# Altium schematic sheet 0167_POWER SEQUENCING.SchDoc (part 1 of 2)
size 848 x 558 mm
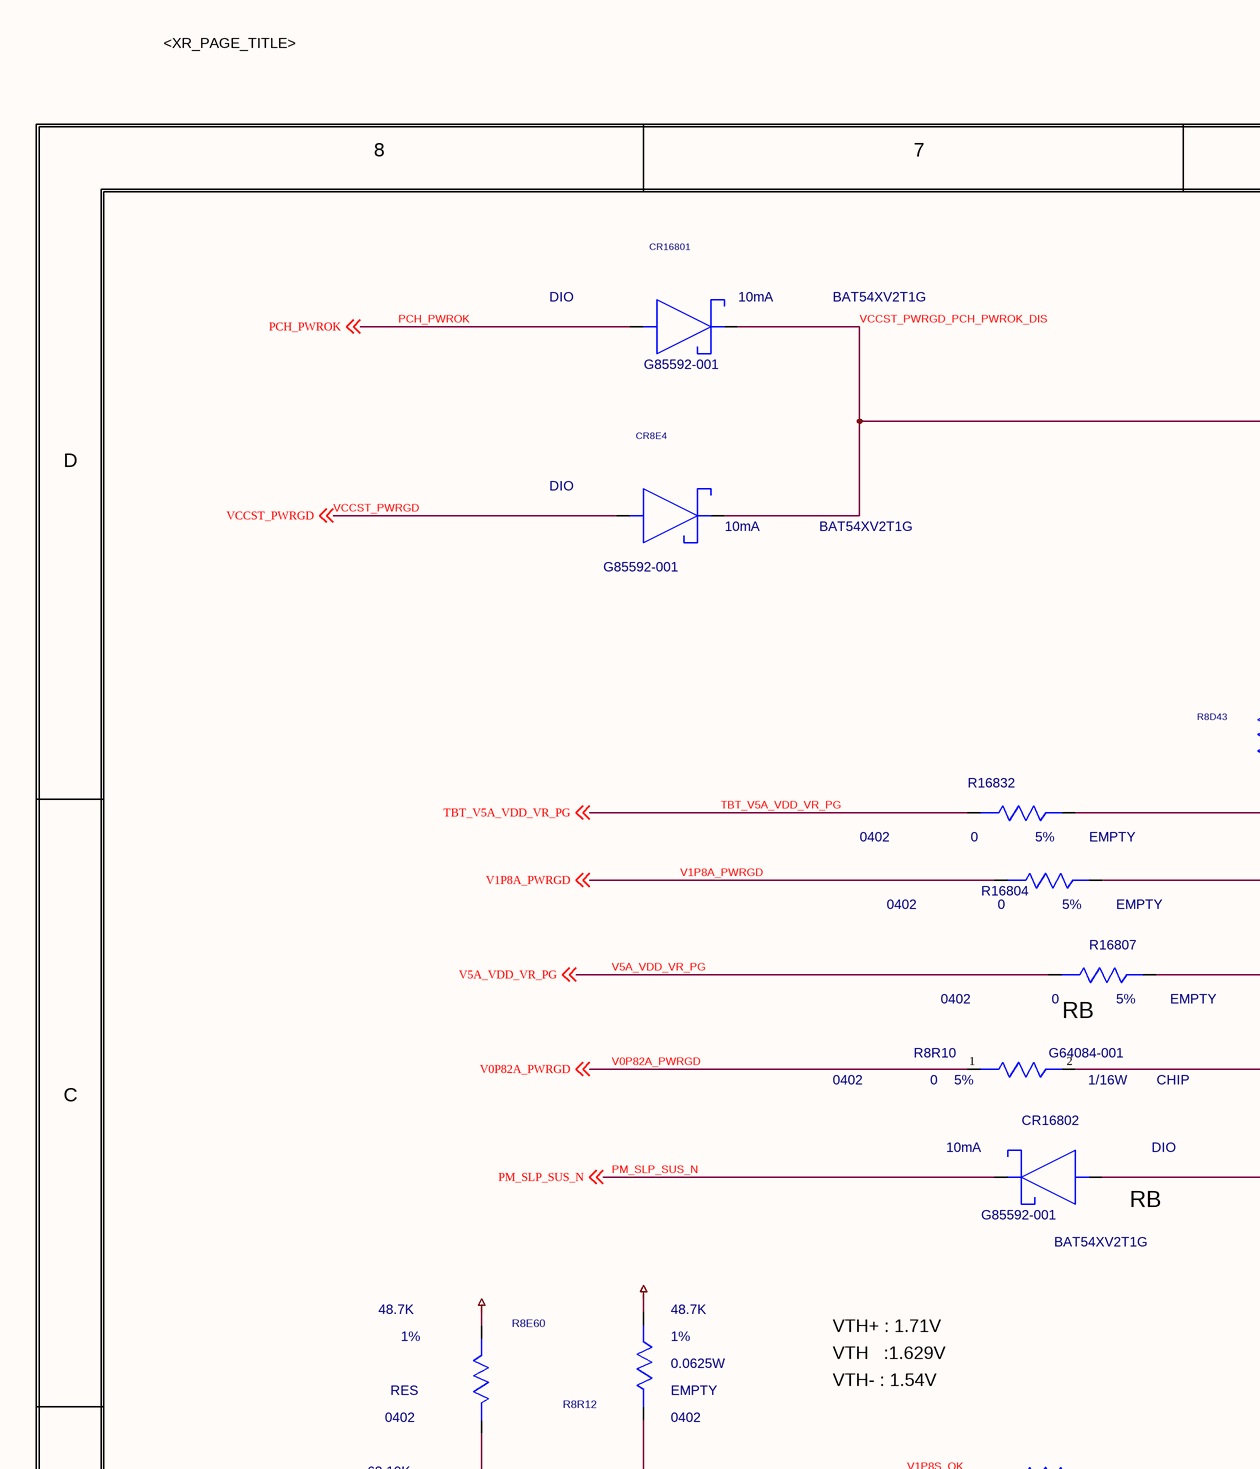
[diagram p0: 0167_POWER SEQUENCING.SchDoc, top left]
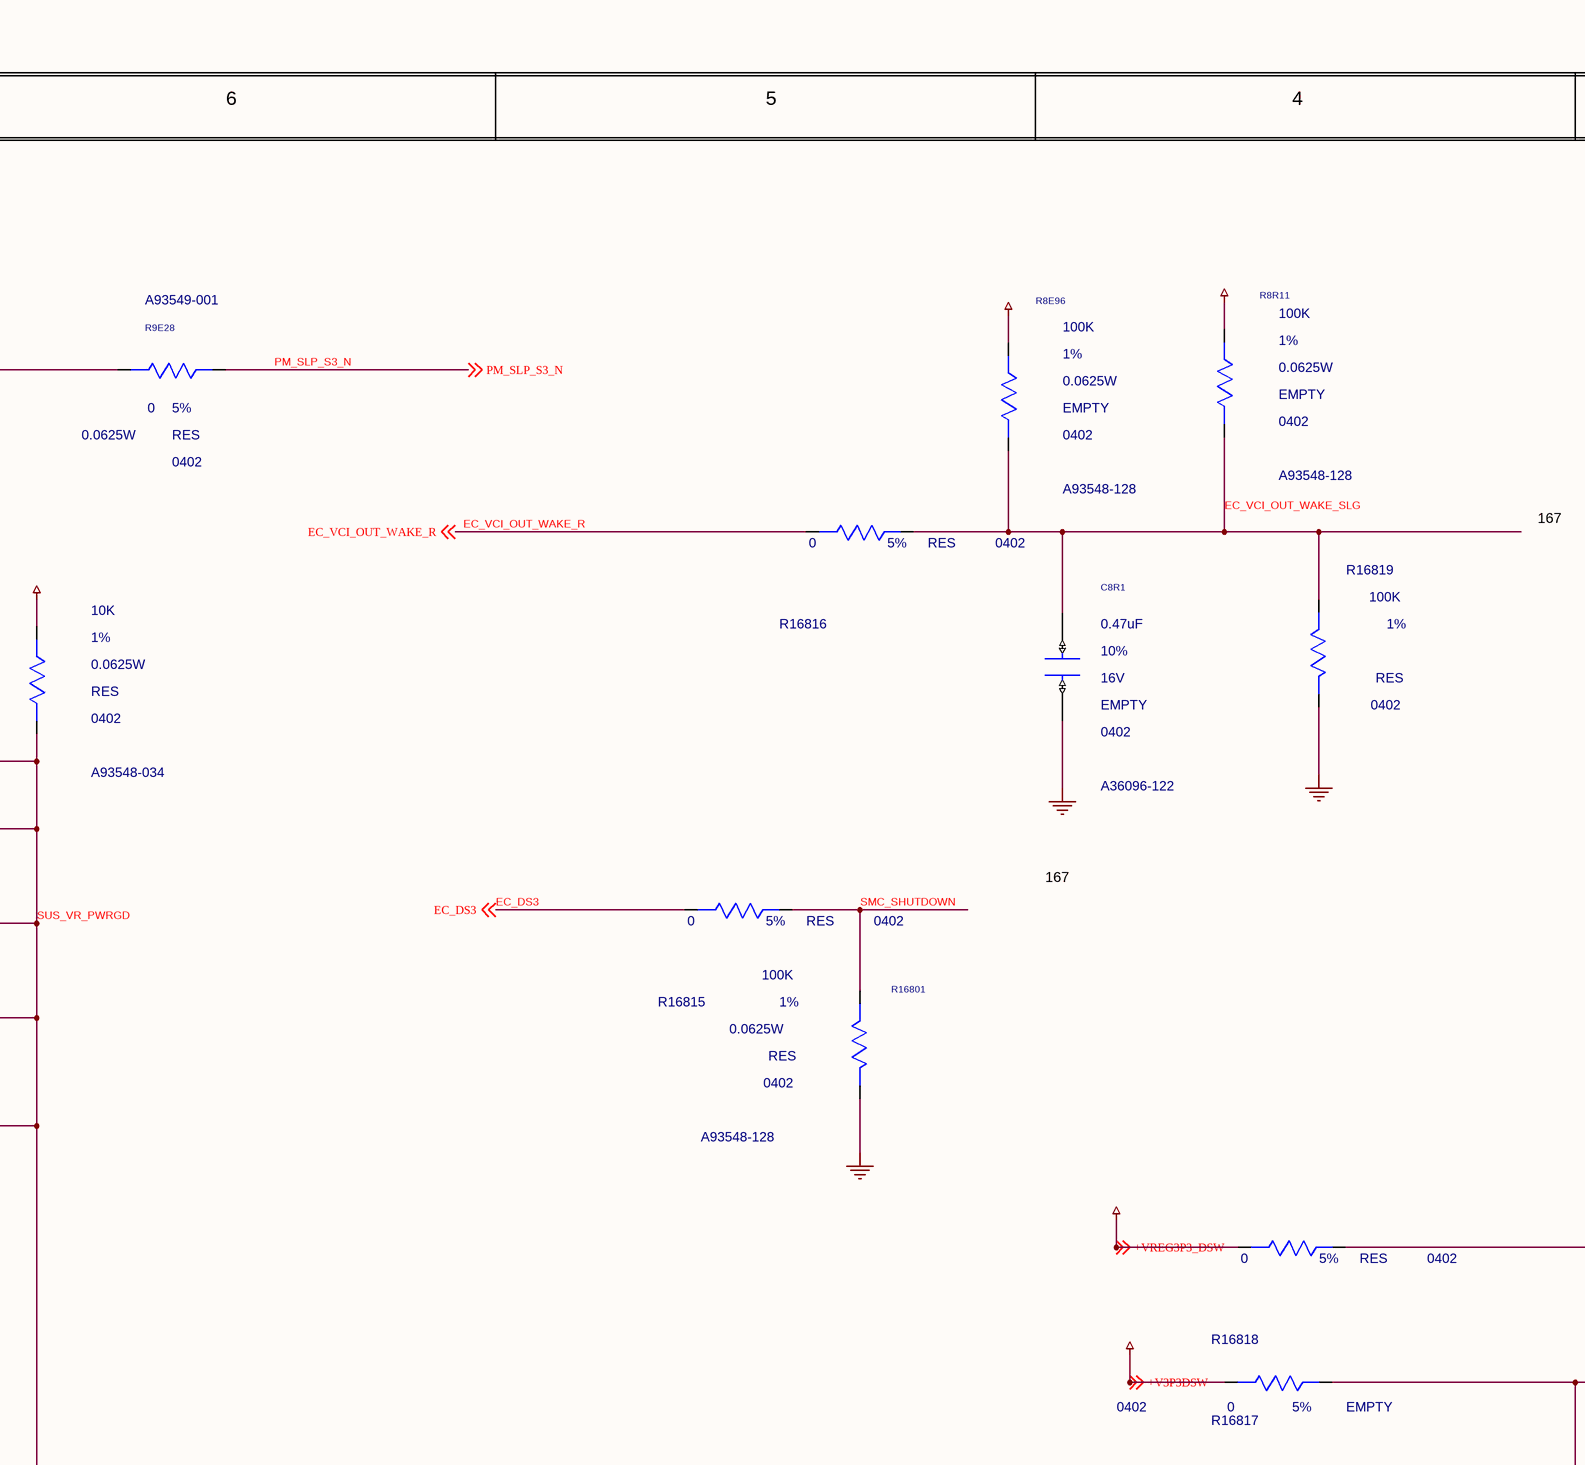
[diagram p1: 0167_POWER SEQUENCING.SchDoc, top middle]
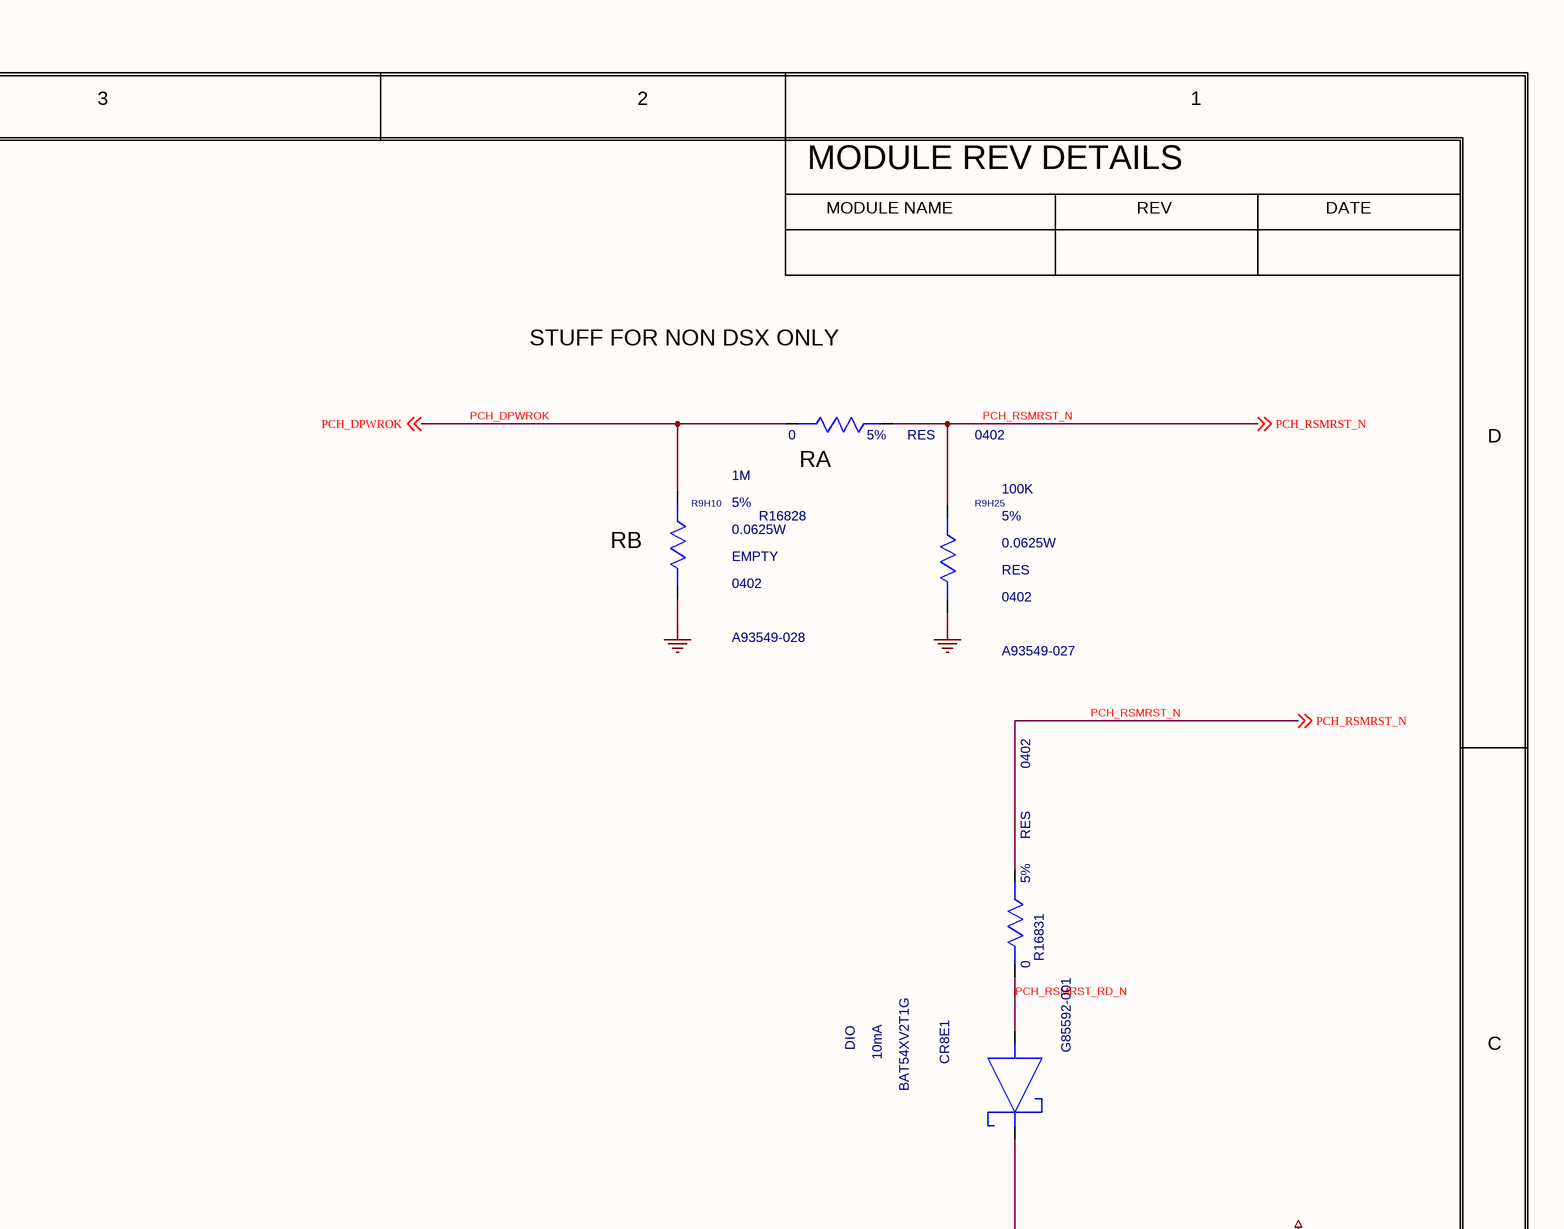
[diagram p2: 0167_POWER SEQUENCING.SchDoc, top right]
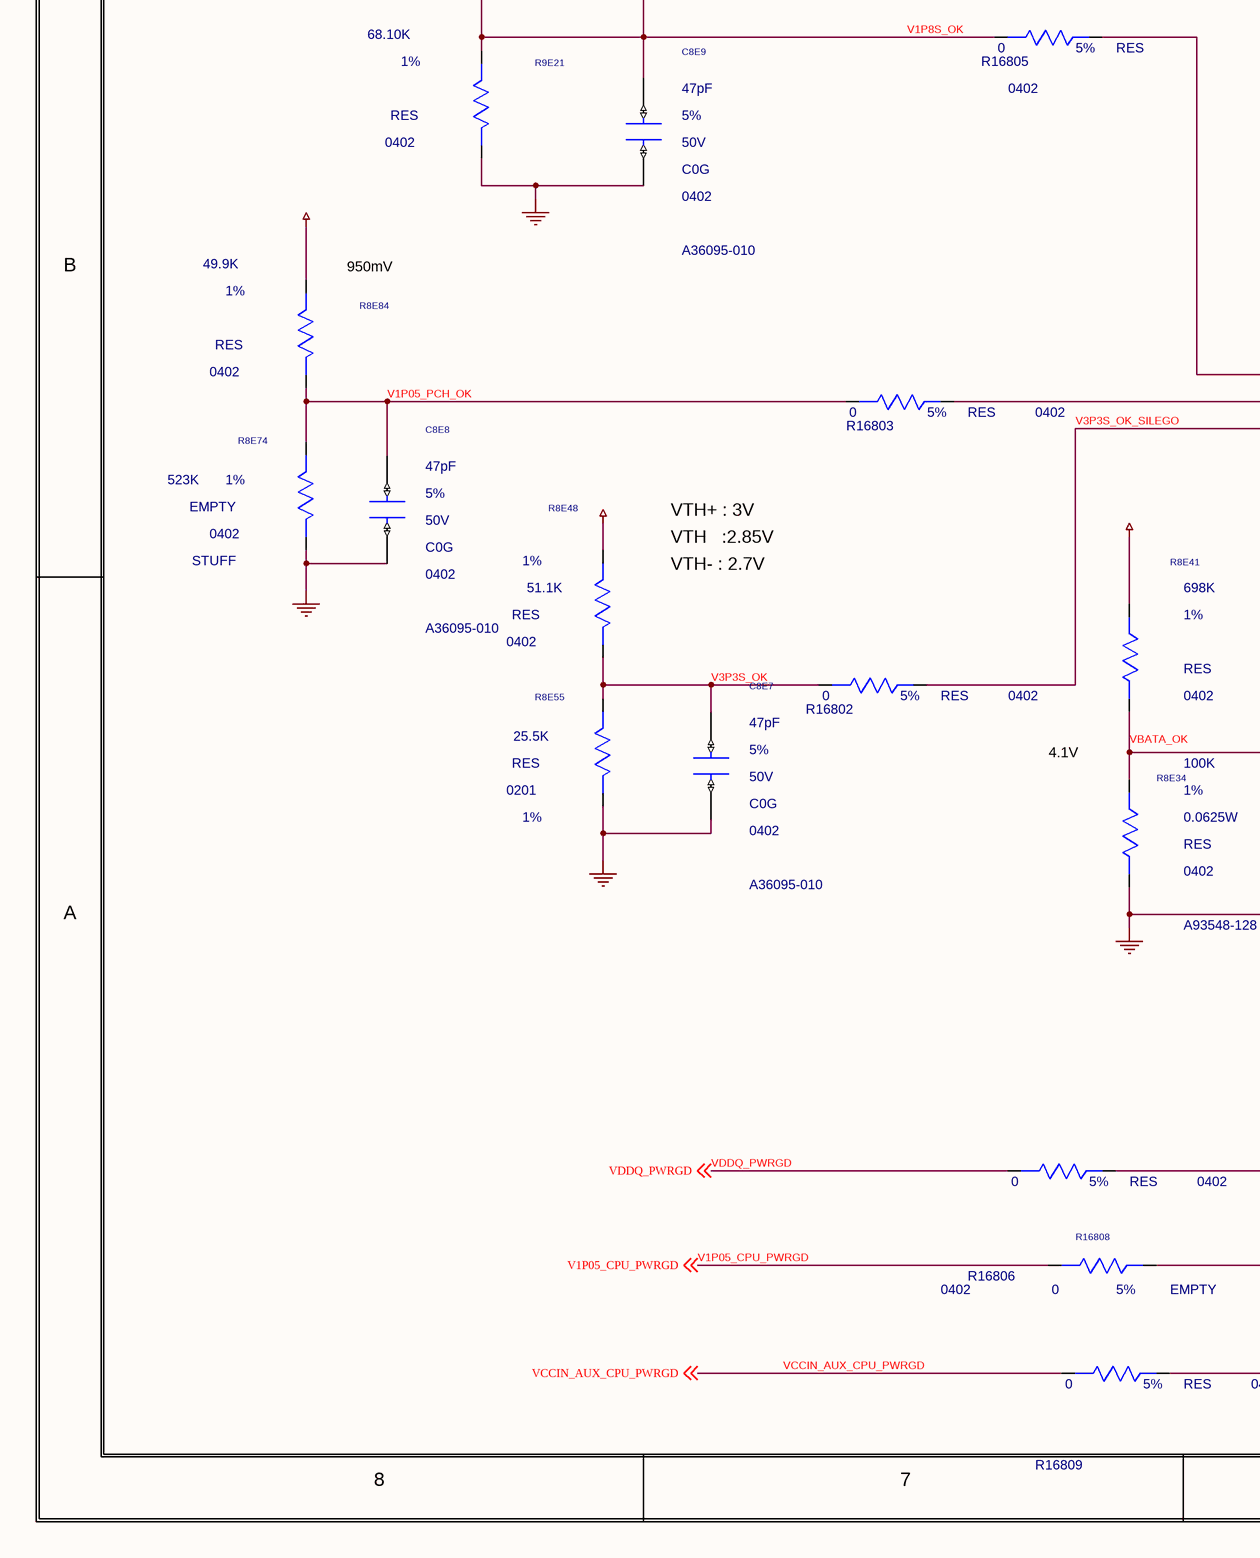
[diagram p3: 0167_POWER SEQUENCING.SchDoc, bottom left]
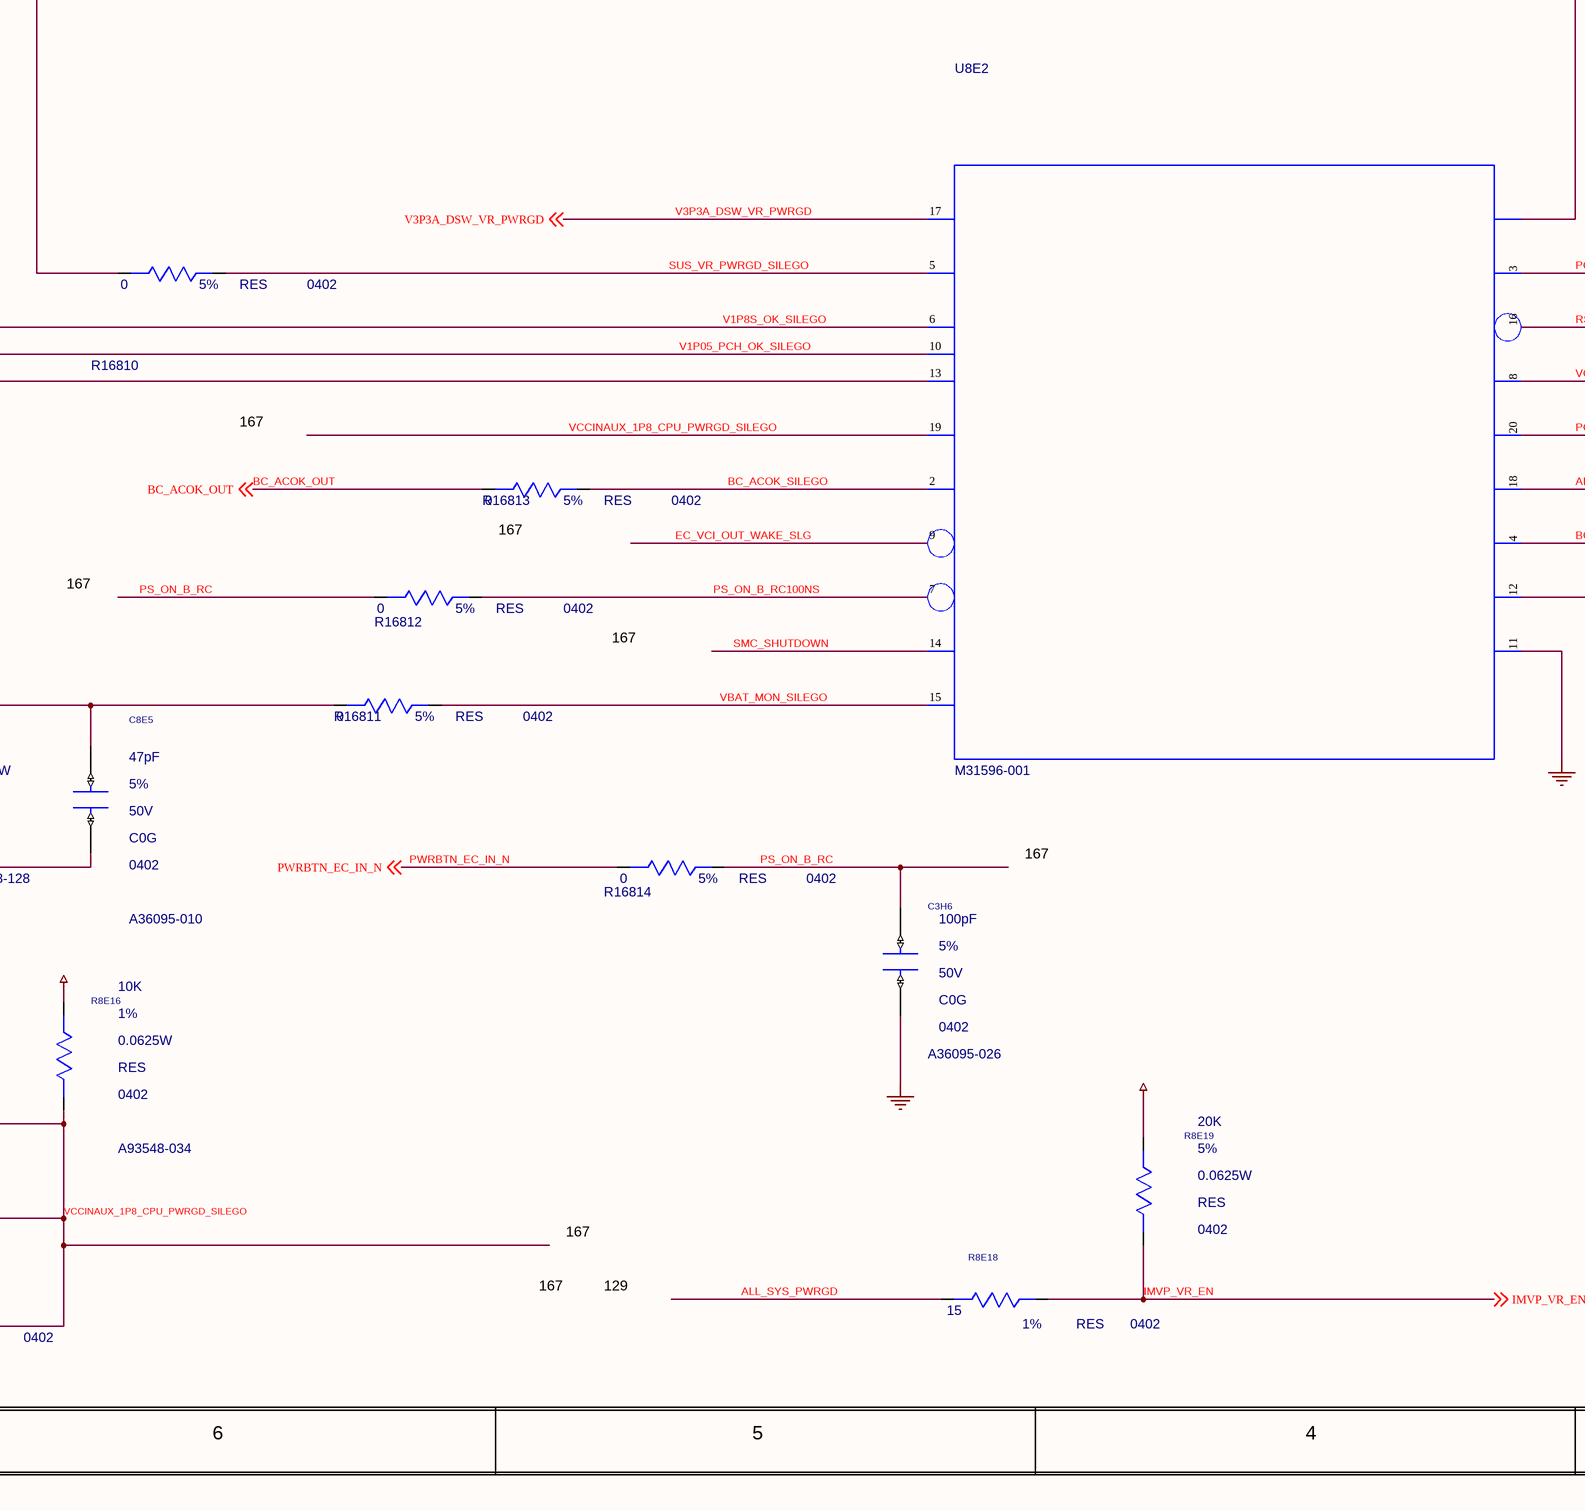
[diagram p4: 0167_POWER SEQUENCING.SchDoc, bottom middle]
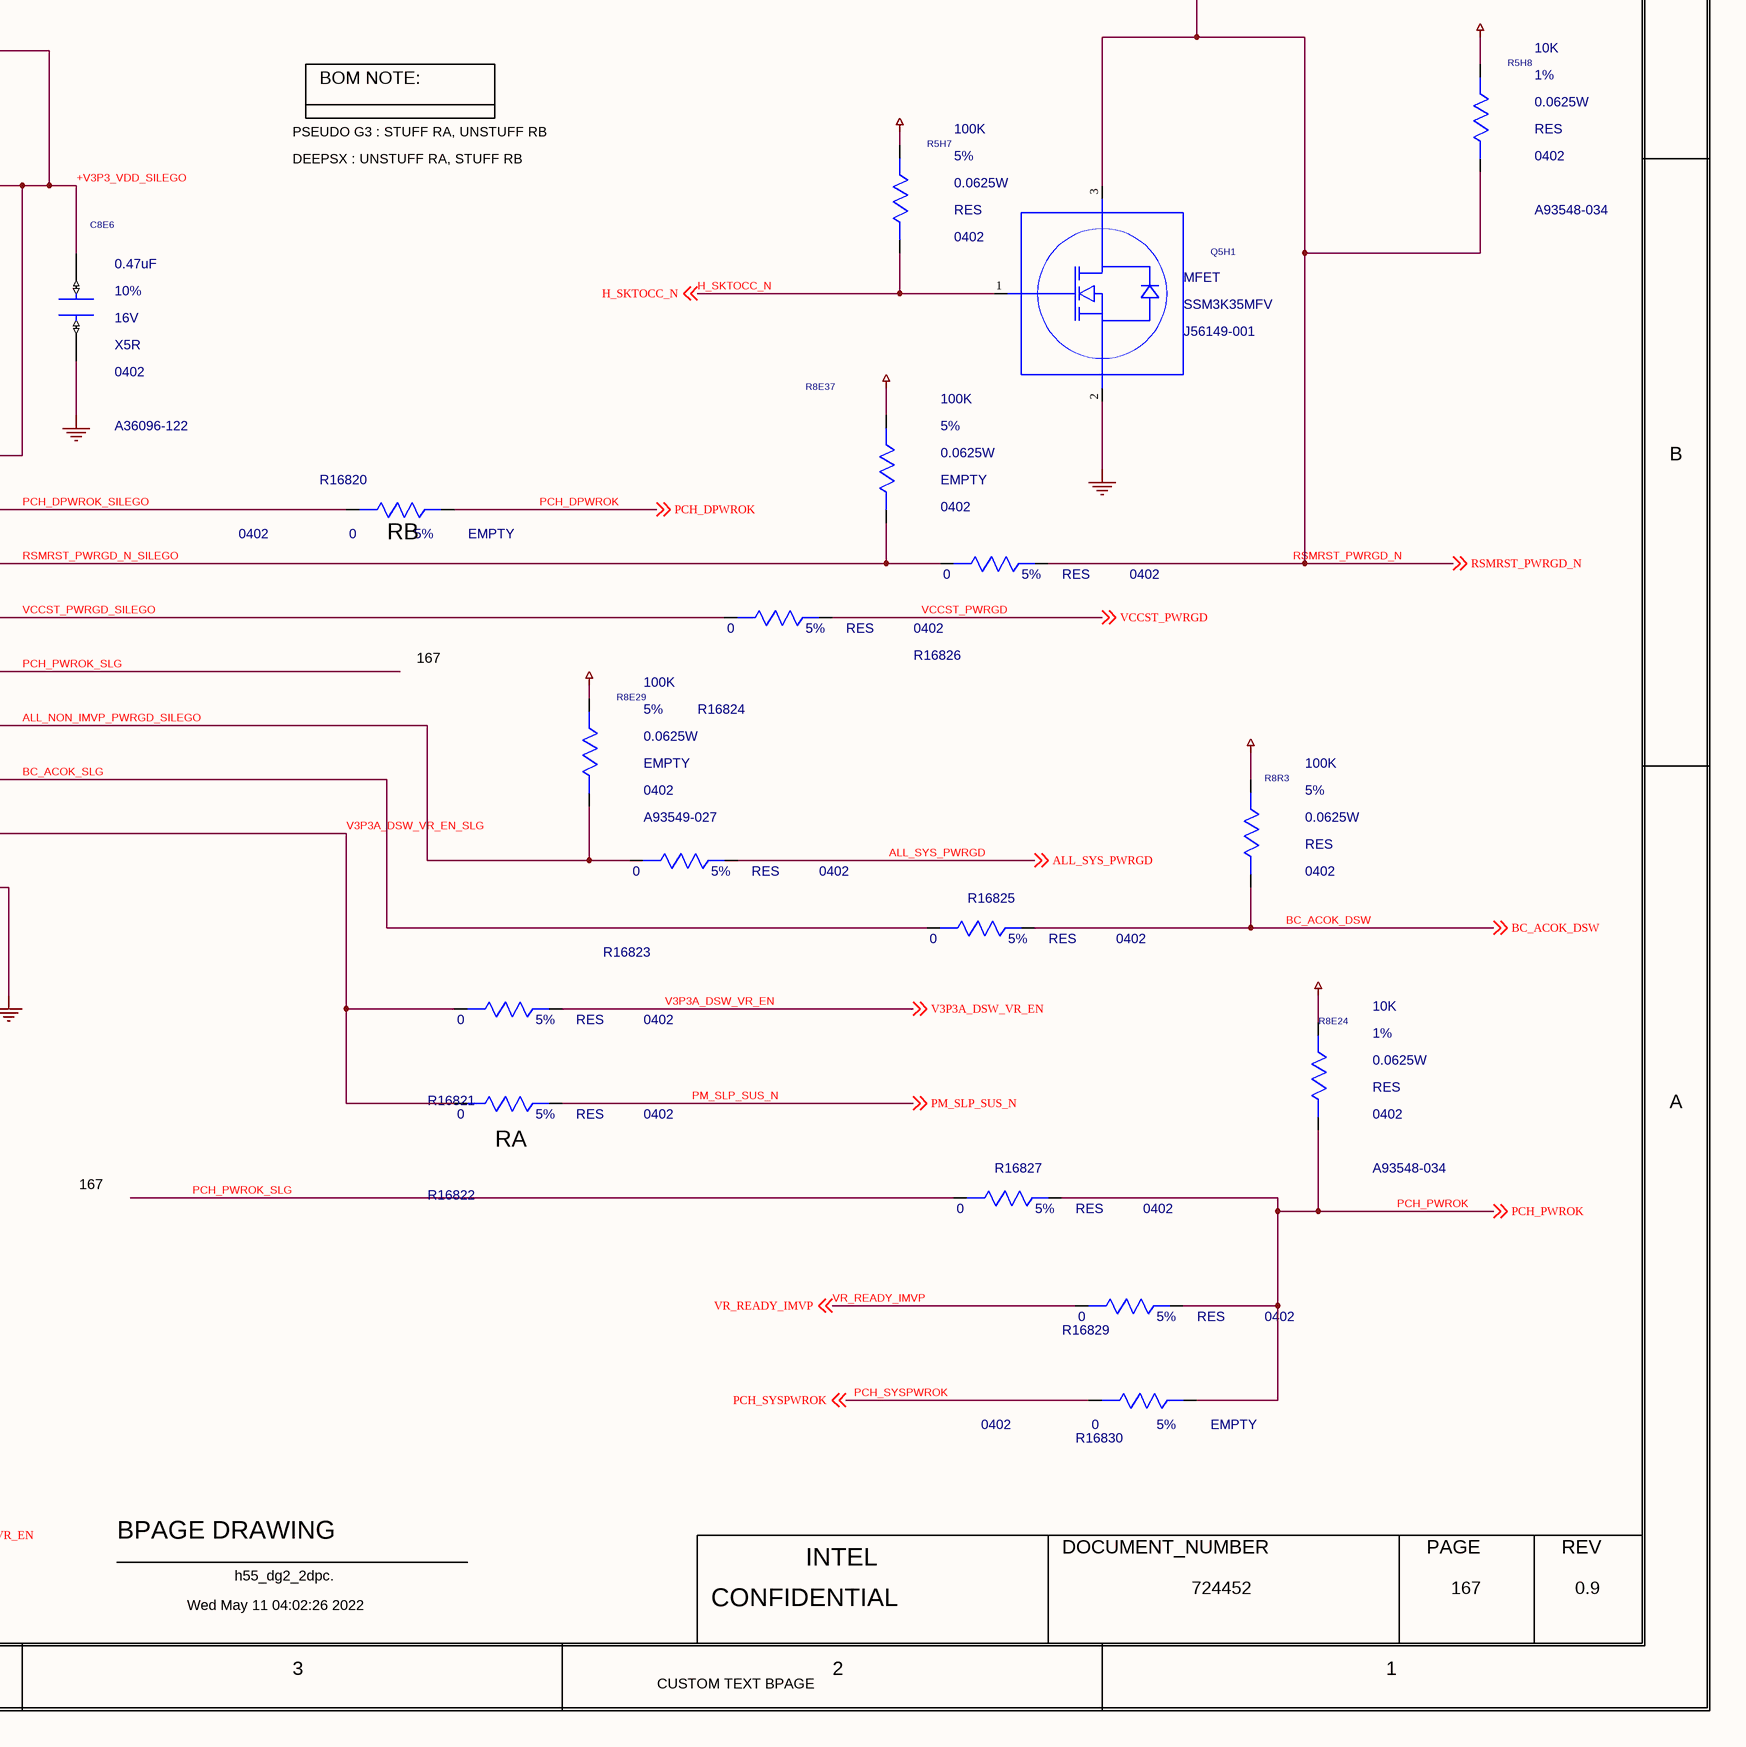
[diagram p5: 0167_POWER SEQUENCING.SchDoc, bottom right]

## Parts
C3H6  100pF  MATERIAL: C0G  PACK_TYPE: 0402  PART_NUMBER: A36095-026  TOLERANCE: 5%  VOLTAGE: 50V  [CTK0_SM0402_1050X550_MA]
C8E5  47pF  MATERIAL: C0G  PACK_TYPE: 0402  PART_NUMBER: A36095-010  TOLERANCE: 5%  VOLTAGE: 50V  [CTK2_SM0402_1050X550_MA]
C8E6  0.47uF  MATERIAL: X5R  PACK_TYPE: 0402  PART_NUMBER: A36096-122  TOLERANCE: 10%  VOLTAGE: 16V  [CTK0_SM0402_1100X600_MA]
C8E7  47pF  MATERIAL: C0G  PACK_TYPE: 0402  PART_NUMBER: A36095-010  TOLERANCE: 5%  VOLTAGE: 50V  [CTK2_SM0402_1050X550_MA]
C8E8  47pF  MATERIAL: C0G  PACK_TYPE: 0402  PART_NUMBER: A36095-010  TOLERANCE: 5%  VOLTAGE: 50V  [CTK2_SM0402_1050X550_MA]
C8E9  47pF  MATERIAL: C0G  PACK_TYPE: 0402  PART_NUMBER: A36095-010  TOLERANCE: 5%  VOLTAGE: 50V  [CTK2_SM0402_1050X550_MA]
C8R1  0.47uF  MATERIAL: EMPTY  PACK_TYPE: 0402  PART_NUMBER: A36096-122  TOLERANCE: 10%  VOLTAGE: 16V  [CTK2_SM0402_1100X600_MA]
CR8E1  BAT54XV2T1G  CURRENT: 10mA  MATERIAL: DIO  PART_NUMBER: G85592-001  [CTK2_SCR_1300X900_MA]
CR8E4  BAT54XV2T1G  CURRENT: 10mA  MATERIAL: DIO  PART_NUMBER: G85592-001  [CTK2_SCR_1300X900_MA]
CR16801  BAT54XV2T1G  CURRENT: 10mA  MATERIAL: DIO  PART_NUMBER: G85592-001  [CTK2_SCR_1300X900_MA]
CR16802  BAT54XV2T1G  CURRENT: 10mA  MATERIAL: DIO  PART_NUMBER: G85592-001  [CTK2_SCR_1300X900_MA]
Q5H1  SSM3K35MFV  MATERIAL: MFET  PART_NUMBER: J56149-001  [CTK2_SOT723_850X1250_400_MA]
R5H7  100K  MATERIAL: RES  PACK_TYPE: 0402  TOLERANCE: 5%  WATTAGE: 0.0625W  [CTK0_SM0402_1100X550_MA]
R5H8  10K  MATERIAL: RES  PACK_TYPE: 0402  PART_NUMBER: A93548-034  TOLERANCE: 1%  WATTAGE: 0.0625W  [CTK2_SM0402_1100X550_MA]
R8D43  10K  MATERIAL: RES  PACK_TYPE: 0402  PART_NUMBER: A93548-034  TOLERANCE: 1%  WATTAGE: 0.0625W  [CTK2_SM0402_1100X550_MA]
R8E16  10K  MATERIAL: RES  PACK_TYPE: 0402  PART_NUMBER: A93548-034  TOLERANCE: 1%  WATTAGE: 0.0625W  [CTK2_SM0402_1100X550_MA]
R8E18  15  MATERIAL: RES  PACK_TYPE: 0402  TOLERANCE: 1%  [CTK2_SM0402_1100X550_MA]
R8E19  20K  MATERIAL: RES  PACK_TYPE: 0402  TOLERANCE: 5%  WATTAGE: 0.0625W  [CTK2_SM0402_1100X550_MA]
R8E24  10K  MATERIAL: RES  PACK_TYPE: 0402  PART_NUMBER: A93548-034  TOLERANCE: 1%  WATTAGE: 0.0625W  [CTK2_SM0402_1100X550_MA]
R8E29  100K  MATERIAL: EMPTY  PACK_TYPE: 0402  PART_NUMBER: A93549-027  TOLERANCE: 5%  WATTAGE: 0.0625W  [CTK0_SM0402_1100X550_MA]
R8E34  100K  MATERIAL: RES  PACK_TYPE: 0402  PART_NUMBER: A93548-128  TOLERANCE: 1%  WATTAGE: 0.0625W  [CTK2_SM0402_1100X550_MA]
R8E37  100K  MATERIAL: EMPTY  PACK_TYPE: 0402  TOLERANCE: 5%  WATTAGE: 0.0625W  [CTK0_SM0402_1100X550_MA]
R8E41  698K  MATERIAL: RES  PACK_TYPE: 0402  TOLERANCE: 1%  [CTK2_SM0402_1100X550_MA]
R8E48  51.1K  MATERIAL: RES  PACK_TYPE: 0402  TOLERANCE: 1%  [CTK2_SM0402_1100X550_MA]
R8E55  25.5K  MATERIAL: RES  PACK_TYPE: 0201  TOLERANCE: 1%  [CTK2_SM0201_650X350_MA]
R8E60  48.7K  MATERIAL: RES  PACK_TYPE: 0402  TOLERANCE: 1%  [CTK2_SM0402_1100X550_MA]
R8E74  523K  BOM_USE: STUFF  MATERIAL: EMPTY  PACK_TYPE: 0402  TOLERANCE: 1%  [TK2_SM0402_1050X550_MA]
R8E84  49.9K  MATERIAL: RES  PACK_TYPE: 0402  TOLERANCE: 1%  [CTK2_SM0402_1100X550_MA]
R8E96  100K  MATERIAL: EMPTY  PACK_TYPE: 0402  PART_NUMBER: A93548-128  TOLERANCE: 1%  WATTAGE: 0.0625W  [CTK2_SM0402_1100X550_MA]
R8R3  100K  MATERIAL: RES  PACK_TYPE: 0402  TOLERANCE: 5%  WATTAGE: 0.0625W  [CTK0_SM0402_1100X550_MA]
R8R10  0  MATERIAL: CHIP  PACK_TYPE: 0402  PART_NUMBER: G64084-001  TOLERANCE: 5%  WATTAGE: 1/16W  [SMR0402IA]
R8R11  100K  MATERIAL: EMPTY  PACK_TYPE: 0402  PART_NUMBER: A93548-128  TOLERANCE: 1%  WATTAGE: 0.0625W  [CTK2_SM0402_1100X550_MA]
R8R12  48.7K  MATERIAL: EMPTY  PACK_TYPE: 0402  TOLERANCE: 1%  WATTAGE: 0.0625W  [CTK2_SM0402_1100X550_MA]
R9E21  68.10K  MATERIAL: RES  PACK_TYPE: 0402  TOLERANCE: 1%  [CTK2_SM0402_1100X550_MA]
R9E28  0  MATERIAL: RES  PACK_TYPE: 0402  PART_NUMBER: A93549-001  TOLERANCE: 5%  WATTAGE: 0.0625W  [CTK0_SM0402_1100X550_MA]
R9H10  1M  MATERIAL: EMPTY  PACK_TYPE: 0402  PART_NUMBER: A93549-028  TOLERANCE: 5%  WATTAGE: 0.0625W  [CTK2_SM0402_1100X550_MA]
R9H25  100K  MATERIAL: RES  PACK_TYPE: 0402  PART_NUMBER: A93549-027  TOLERANCE: 5%  WATTAGE: 0.0625W  [CTK0_SM0402_1100X550_MA]
R16801  100K  MATERIAL: RES  PACK_TYPE: 0402  PART_NUMBER: A93548-128  TOLERANCE: 1%  WATTAGE: 0.0625W  [CTK0_SM0402_1100X550_MA]
R16802  0  MATERIAL: RES  PACK_TYPE: 0402  TOLERANCE: 5%  [CTK0_SM0402_1100X550_MA]
R16803  0  MATERIAL: RES  PACK_TYPE: 0402  TOLERANCE: 5%  [CTK0_SM0402_1100X550_MA]
R16804  0  MATERIAL: EMPTY  PACK_TYPE: 0402  TOLERANCE: 5%  [CTK0_SM0402_1100X550_MA]
R16805  0  MATERIAL: RES  PACK_TYPE: 0402  TOLERANCE: 5%  [CTK0_SM0402_1100X550_MA]
R16806  0  MATERIAL: RES  PACK_TYPE: 0402  TOLERANCE: 5%  [CTK0_SM0402_1100X550_MA]
R16807  0  MATERIAL: EMPTY  PACK_TYPE: 0402  TOLERANCE: 5%  [CTK0_SM0402_1100X550_MA]
R16808  0  MATERIAL: EMPTY  PACK_TYPE: 0402  TOLERANCE: 5%  [CTK0_SM0402_1100X550_MA]
R16809  0  MATERIAL: RES  PACK_TYPE: 0402  TOLERANCE: 5%  [CTK0_SM0402_1100X550_MA]
R16810  0  MATERIAL: RES  PACK_TYPE: 0402  TOLERANCE: 5%  [CTK0_SM0402_1100X550_MA]
R16811  0  MATERIAL: RES  PACK_TYPE: 0402  TOLERANCE: 5%  [CTK0_SM0402_1100X550_MA]
R16812  0  MATERIAL: RES  PACK_TYPE: 0402  TOLERANCE: 5%  [CTK0_SM0402_1100X550_MA]
R16813  0  MATERIAL: RES  PACK_TYPE: 0402  TOLERANCE: 5%  [CTK0_SM0402_1100X550_MA]
R16814  0  MATERIAL: RES  PACK_TYPE: 0402  TOLERANCE: 5%  [CTK0_SM0402_1100X550_MA]
R16815  0  MATERIAL: RES  PACK_TYPE: 0402  TOLERANCE: 5%  [CTK0_SM0402_1100X550_MA]
R16816  0  MATERIAL: RES  PACK_TYPE: 0402  TOLERANCE: 5%  [CTK0_SM0402_1100X550_MA]
R16817  0  MATERIAL: EMPTY  PACK_TYPE: 0402  TOLERANCE: 5%  [CTK0_SM0402_1100X550_MA]
R16818  0  MATERIAL: RES  PACK_TYPE: 0402  TOLERANCE: 5%  [CTK0_SM0402_1100X550_MA]
R16819  100K  MATERIAL: RES  PACK_TYPE: 0402  TOLERANCE: 1%  [CTK0_SM0402_1100X550_MA]
R16820  0  MATERIAL: EMPTY  PACK_TYPE: 0402  TOLERANCE: 5%  [CTK0_SM0402_1100X550_MA]
R16821  0  MATERIAL: RES  PACK_TYPE: 0402  TOLERANCE: 5%  [CTK0_SM0402_1100X550_MA]
R16822  0  MATERIAL: RES  PACK_TYPE: 0402  TOLERANCE: 5%  [CTK0_SM0402_1100X550_MA]
R16823  0  MATERIAL: RES  PACK_TYPE: 0402  TOLERANCE: 5%  [CTK0_SM0402_1100X550_MA]
R16824  0  MATERIAL: RES  PACK_TYPE: 0402  TOLERANCE: 5%  [CTK0_SM0402_1100X550_MA]
R16825  0  MATERIAL: RES  PACK_TYPE: 0402  TOLERANCE: 5%  [CTK0_SM0402_1100X550_MA]
R16826  0  MATERIAL: RES  PACK_TYPE: 0402  TOLERANCE: 5%  [CTK0_SM0402_1100X550_MA]
R16827  0  MATERIAL: RES  PACK_TYPE: 0402  TOLERANCE: 5%  [CTK0_SM0402_1100X550_MA]
R16828  0  MATERIAL: RES  PACK_TYPE: 0402  TOLERANCE: 5%  [CTK0_SM0402_1100X550_MA]
R16829  0  MATERIAL: RES  PACK_TYPE: 0402  TOLERANCE: 5%  [CTK0_SM0402_1100X550_MA]
R16830  0  MATERIAL: EMPTY  PACK_TYPE: 0402  TOLERANCE: 5%  [CTK0_SM0402_1100X550_MA]
R16831  0  MATERIAL: RES  PACK_TYPE: 0402  TOLERANCE: 5%  [CTK0_SM0402_1100X550_MA]
R16832  0  MATERIAL: EMPTY  PACK_TYPE: 0402  TOLERANCE: 5%  [CTK0_SM0402_1100X550_MA]
U8E2  PART_NUMBER: M31596-001  [CTK2_LCC20_2050X3050_400_MA_MR]  (hidden comment: C_SLG7NT44603)

## Nets
+V1P05A_PCH: R8E84.1(A)
+V1P8S: R8E60.1(A)
+V3P3A: R5H7.1(A) R5H8.1(A) R8D43.1(A) R8E37.1(A)
+V3P3DSW: R8E96.1(A) R8R3.1(A) R16817.1(A) ; off-sheet +V3P3DSW
+V3P3S: R8E16.1(A) R8E19.1(A) R8E24.1(A) R8E29.1(A) R8E48.1(A)
+VBATA: R8E41.1(A)
+VCC1P8_PROC: R8R12.1(A)
+VREG3P3_DSW: R8R11.1(A) R16818.1(A) ; off-sheet +VREG3P3_DSW
GND: C3H6.2(B) C8E5.2(B) C8E6.2(B) C8E7.2(B) C8E8.2(B) C8E9.2(B) C8R1.2(B) Q5H1.2(S) R8E34.2(B) R8E55.2(B) R8E74.2(B) R9E21.2(B) R9H10.2(B) R9H25.2(B) R16801.2(B) R16819.2(B) U8E2.11(GND)
VDD: U8E2.1(VDD)
+V3P3_VDD_SILEGO: C8E6.1(A) R16817.2(B) R16818.2(B)
ALL_NON_IMVP_PWRGD_SILEGO: R8E29.2(B) R16823.1(A) U8E2.18(ALL_SYS_PWRGD)
ALL_SYS_PWRGD: R8E18.1(A) R16823.2(B) ; off-sheet ALL_SYS_PWRGD
BC_ACOK_DSW: R8R3.2(B) R16825.2(B) ; off-sheet BC_ACOK_DSW
BC_ACOK_OUT: R16813.1(A) ; off-sheet BC_ACOK_OUT
BC_ACOK_SILEGO: R16813.2(B) U8E2.2(BC_ACOK_IN)
BC_ACOK_SLG: R16825.1(A) U8E2.4(BC_ACOK_DSW)
EC_DS3: R16815.1(A) ; off-sheet EC_DS3
EC_VCI_OUT_WAKE_R: R16816.1(A) ; off-sheet EC_VCI_OUT_WAKE_R
EC_VCI_OUT_WAKE_SLG: C8R1.1(A) R8E96.2(B) R8R11.2(B) R16816.2(B) R16819.1(A) U8E2.9(EC_RTC_WAKE_N)
H_SKTOCC_N: Q5H1.1(G) R5H7.2(B) ; off-sheet H_SKTOCC_N
IMVP_VR_EN: R8E18.2(B) R8E19.2(B) ; off-sheet IMVP_VR_EN
PCH_DPWROK: R9H10.1(A) R16820.2(B) R16828.1(A) ; off-sheet PCH_DPWROK
PCH_DPWROK_SILEGO: R16820.1(A) U8E2.3(DPWROK)
PCH_PWROK: CR16801.A(ANODE) R8E24.2(B) R16827.2(B) R16829.2(B) R16830.2(B) ; off-sheet PCH_PWROK
PCH_PWROK_SLG: R16827.1(A) U8E2.20(PCH_PWROK)
PCH_RSMRST_N: R9H25.1(A) R16828.2(B) R16831.2(B) ; off-sheet PCH_RSMRST_N
PCH_RSMRST_RD_N: CR8E1.A(ANODE) R16831.1(A)
PCH_SYSPWROK: R16830.1(A) ; off-sheet PCH_SYSPWROK
PM_SLP_S3_N: R9E28.2(B) ; off-sheet PM_SLP_S3_N
PM_SLP_SUS_N: CR16802.C(CATHODE) R16822.2(B) ; off-sheet PM_SLP_SUS_N
PS_ON_B_RC: C3H6.1(A) R16812.1(A) R16814.2(B)
PS_ON_B_RC100NS: R16812.2(B) U8E2.7(PWRBTN_N)
PWRBTN_EC_IN_N: R16814.1(A) ; off-sheet PWRBTN_EC_IN_N
RSMRST_PWRGD_N: CR8E1.C(CATHODE) Q5H1.3(D) R5H8.2(B) R16826.2(B) ; off-sheet RSMRST_PWRGD_N
RSMRST_PWRGD_N_SILEGO: R8E37.2(B) R16826.1(A) U8E2.16(RSMRST_PWRGD_N)
SMC_SHUTDOWN: R16801.1(A) R16815.2(B) U8E2.14(EC_DS3)
SUS_VR_PWRGD: CR16802.A(ANODE) R8D43.2(B) R8R10.2(B) R16804.2(B) R16807.2(B) R16810.1(A) R16832.2(B)
SUS_VR_PWRGD_SILEGO: R16810.2(B) U8E2.5(SUS_VR_PWRGD)
TBT_V5A_VDD_VR_PG: R16832.1(A) ; off-sheet TBT_V5A_VDD_VR_PG
V0P82A_PWRGD: R8R10.1(A) ; off-sheet V0P82A_PWRGD
V1P05_CPU_PWRGD: R16808.1(A) ; off-sheet V1P05_CPU_PWRGD
V1P05_PCH_OK: C8E8.1(A) R8E74.1(A) R8E84.2(B) R16803.1(A)
V1P05_PCH_OK_SILEGO: R16803.2(B) U8E2.10(V2)
V1P8A_PWRGD: R16804.1(A) ; off-sheet V1P8A_PWRGD
V1P8S_OK: C8E9.1(A) R8E60.2(B) R8R12.2(B) R9E21.1(A) R16805.1(A)
V1P8S_OK_SILEGO: R16805.2(B) U8E2.6(V1)
V3P3A_DSW_VR_EN: R16821.2(B) ; off-sheet V3P3A_DSW_VR_EN
V3P3A_DSW_VR_EN_SLG: R16821.1(A) R16822.1(A) U8E2.12(V3P3_DSW_VR_EN)
V3P3A_DSW_VR_PWRGD: U8E2.17(V3P3DSW_PWRGD) ; off-sheet V3P3A_DSW_VR_PWRGD
V3P3S_OK: C8E7.1(A) R8E48.2(B) R8E55.1(A) R16802.1(A)
V3P3S_OK_SILEGO: R16802.2(B) U8E2.13(V3)
V5A_VDD_VR_PG: R16807.1(A) ; off-sheet V5A_VDD_VR_PG
VBAT_MON_SILEGO: R16811.2(B) U8E2.15(VBAT_MON)
VBATA_OK: C8E5.1(A) R8E34.1(A) R8E41.2(B) R16811.1(A)
VCCIN_AUX_CPU_PWRGD: R16809.1(A) ; off-sheet VCCIN_AUX_CPU_PWRGD
VCCINAUX_1P8_CPU_PWRGD_SILEGO: R8E16.2(B) R16806.2(B) R16808.2(B) R16809.2(B) U8E2.19(VCCINAUX_PG_DDR_V)
VCCST_PWRGD: CR8E4.A(ANODE) R16824.2(B) ; off-sheet VCCST_PWRGD
VCCST_PWRGD_PCH_PWROK_DIS: CR8E4.C(CATHODE) CR16801.C(CATHODE) R9E28.1(A)
VCCST_PWRGD_SILEGO: R16824.1(A) U8E2.8(VCCST_PWRGD)
VDDQ_PWRGD: R16806.1(A) ; off-sheet VDDQ_PWRGD
VR_READY_IMVP: R16829.1(A) ; off-sheet VR_READY_IMVP

## Notes on the sheet
- <XR_PAGE_TITLE>
- 8
- 7
- 6
- 5
- 4
- 3
- 2
- 1
- MODULE REV DETAILS
- MODULE NAME
- REV
- DATE
- STUFF FOR NON DSX ONLY
- D
- (near R16828) RA
- 167
- (near R9H10) RB
- (near R16807) RB
- C
- (near CR16802) RB
- VTH+ : 1.71V
- BOM NOTE:
- VTH   :1.629V
- VTH- : 1.54V
- PSEUDO G3 : STUFF RA, UNSTUFF RB
- DEEPSX : UNSTUFF RA, STUFF RB
- B
- (near R8E84) 950mV
- (near R16820) RB
- VTH+ : 3V
- VTH   :2.85V
- VTH- : 2.7V
- (near R16813) 167
- 4.1V
- A
- (near R16822) RA
- 129
- BPAGE DRAWING
- INTEL
- DOCUMENT_NUMBER
- PAGE
- Wed May 11 04:02:26 2022
- h55_dg2_2dpc.
- CONFIDENTIAL
- 724452
- 0.9
- CUSTOM TEXT BPAGE